# Altium schematic sheet УШЯИ.411618.029Э Э3 Лист 5.schdoc (part 2 of 2)
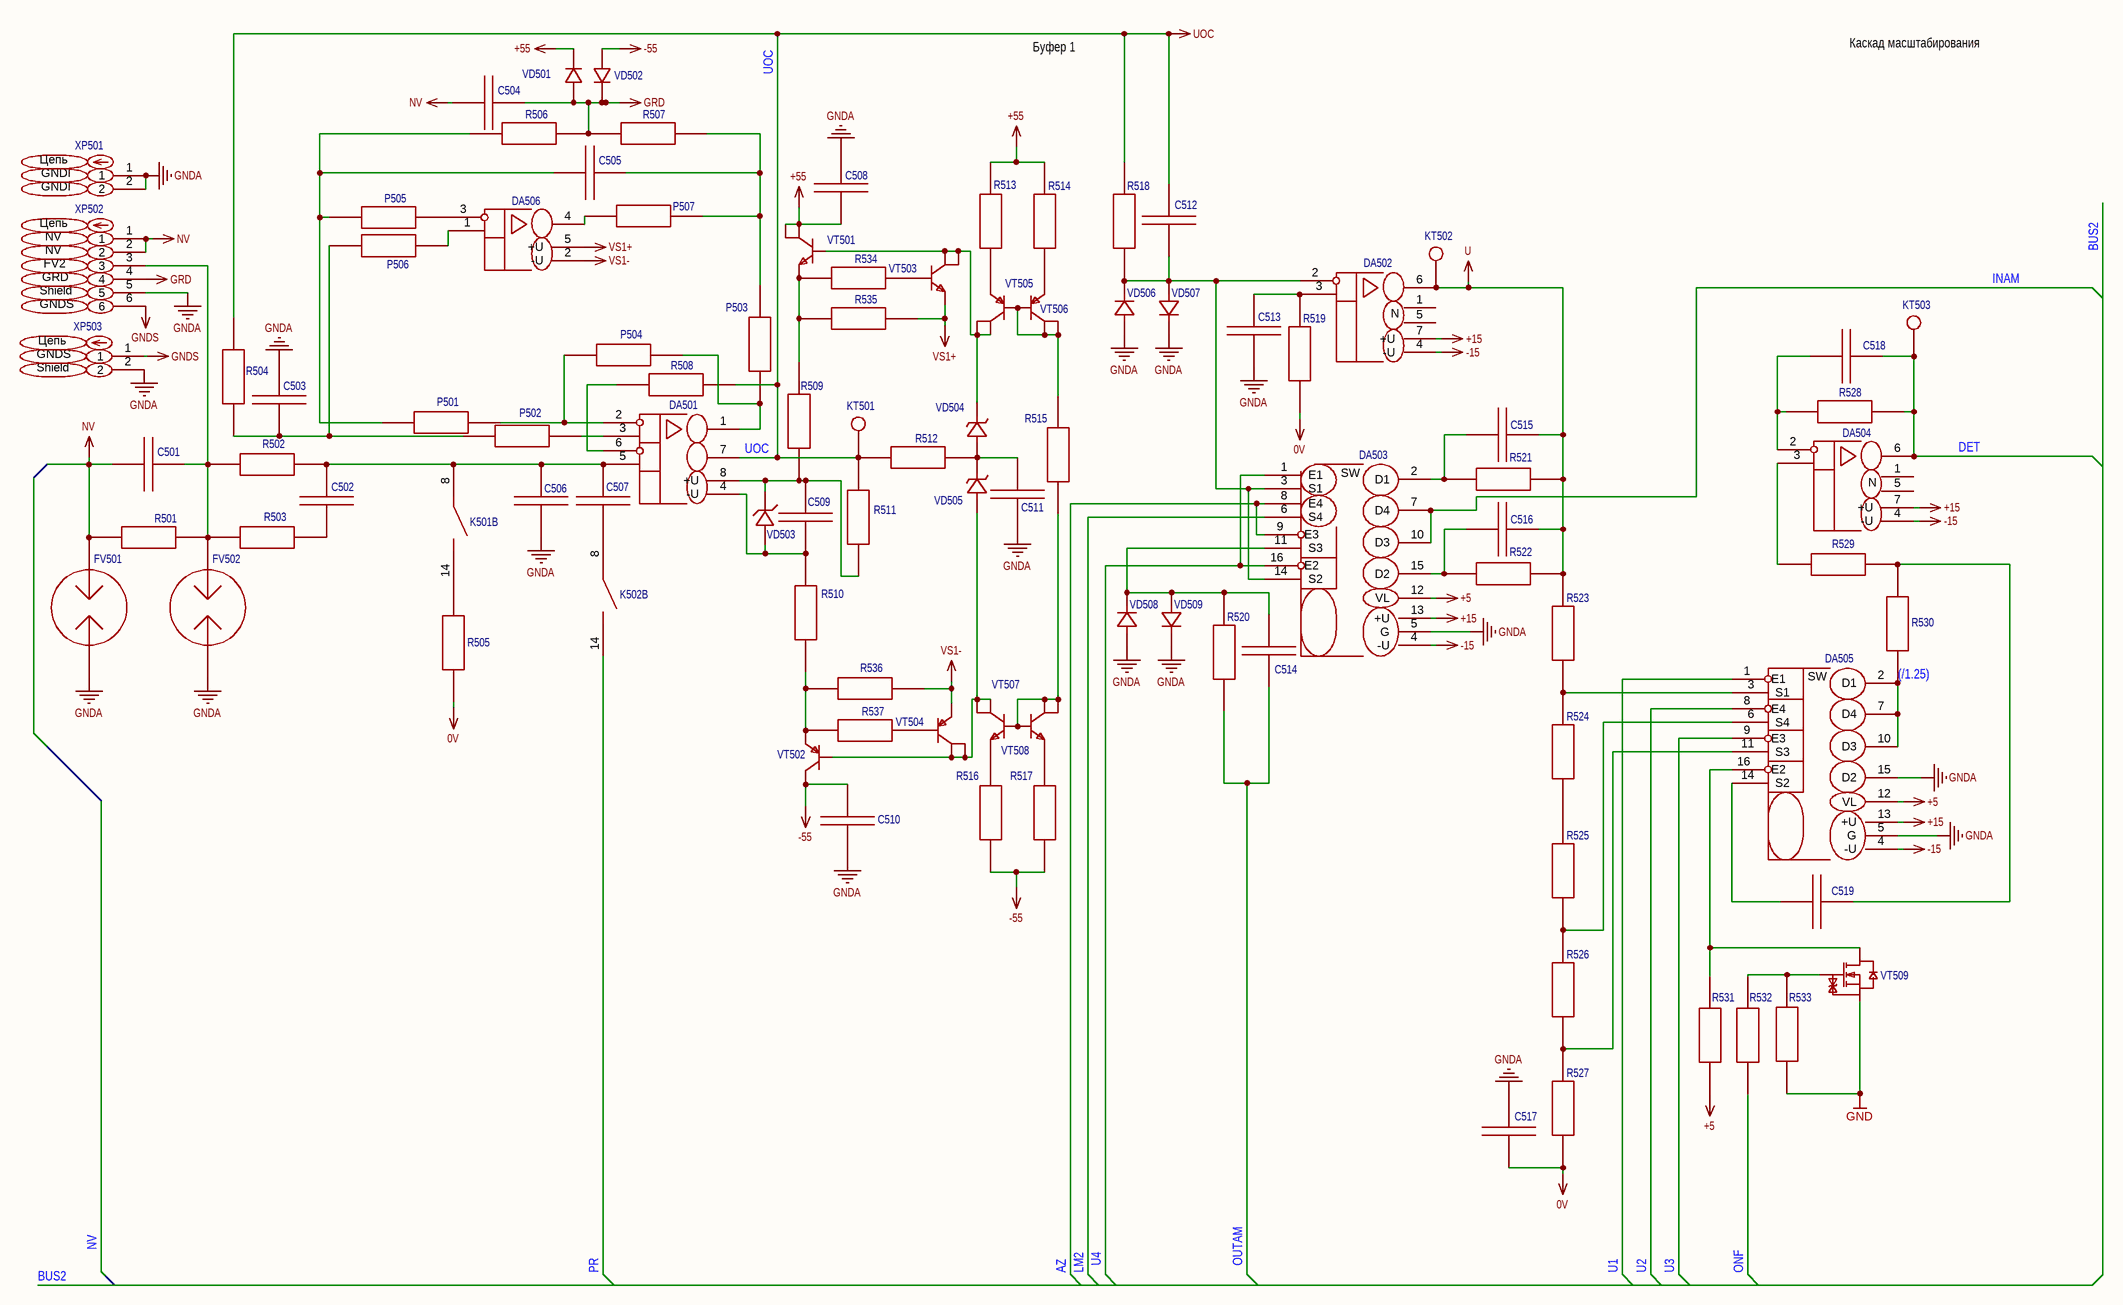
[diagram p1: УШЯИ.411618.029Э Э3 Лист 5.schdoc]

## Library data of the parts
C501 = Конденсатор К10-17Б М47 47пФ  NP0 5% [DIP]: Contributor: jordanjin; Convert to PCB: yes; UniqueId: gge491fe3ed6471c83b; Origin Footprint: К10-17Б М47; Device: Конденсатор К10-17Б М47 47пФ  NP0 5% [DIP]; Symbol: Конденсатор К10-17Б М47 47пФ  NP0 5% [DIP]; Manufacturer Part: К10-17Б М47; Add into BOM: yes; spicePre: C; spiceSymbolName: Конденсатор К10-17Б М47 33пФ NP0 5% [DIP]
C502 = Конденсатор К10-17Б М47 47пФ  NP0 5% [DIP]: Contributor: jordanjin; Convert to PCB: yes; UniqueId: gge052eea8d6ff6ddb1; Origin Footprint: К10-17Б М47; Device: Конденсатор К10-17Б М47 47пФ  NP0 5% [DIP]; Symbol: Конденсатор К10-17Б М47 47пФ  NP0 5% [DIP]; Manufacturer Part: К10-17Б М47; Add into BOM: yes; spicePre: C; spiceSymbolName: Конденсатор К10-17Б М47 33пФ NP0 5% [DIP]
C503 = Конденсатор SMD 10пФ 100В X7R 10% [0805]: Contributor: jordanjin; Convert to PCB: yes; UniqueId: gge9d51e8d6ddafb28b; Origin Footprint: C0805; Device: Конденсатор SMD 10пФ 100В X7R 10% [0805]; Symbol: Конденсатор SMD 10пФ 100В X7R 10% [0805]; Manufacturer Part: C0805; Add into BOM: yes; spicePre: C; spiceSymbolName: Конденсатор SMD 100нФ 100В X7R 10% [0805]; FootprintName: C0805
C504 = Конденсатор К10-17Б М47 0,022мкФ  NP0 5% [DIP]: Contributor: jordanjin; Convert to PCB: yes; UniqueId: ggef415597d1a4119d4; Origin Footprint: К10-17Б М47; Device: Конденсатор К10-17Б М47 0,022мкФ  NP0 5% [DIP]; Symbol: Конденсатор К10-17Б М47 0,022мкФ  NP0 5% [DIP]; Manufacturer Part: К10-17Б М47; Add into BOM: yes; spicePre: C; spiceSymbolName: Конденсатор К10-17Б М47 33пФ NP0 5% [DIP]
C505 = Конденсатор К10-17Б М47 10пФ  NP0 5% [DIP]: Contributor: jordanjin; Convert to PCB: yes; UniqueId: gge0dc5cfc7d6f056c5; Origin Footprint: К10-17Б М47; Device: Конденсатор К10-17Б М47 10пФ  NP0 5% [DIP]; Symbol: Конденсатор К10-17Б М47 10пФ  NP0 5% [DIP]; Manufacturer Part: К10-17Б М47; Add into BOM: yes; spicePre: C; spiceSymbolName: Конденсатор К10-17Б М47 33пФ NP0 5% [DIP]
C506 = Конденсатор К10-17Б М47 33пФ  NP0 5% [DIP]: Contributor: jordanjin; Convert to PCB: yes; UniqueId: gge7a5b28f25b65ab49; Origin Footprint: К10-17Б М47; Device: Конденсатор К10-17Б М47 33пФ  NP0 5% [DIP]; Symbol: Конденсатор К10-17Б М47 33пФ  NP0 5% [DIP]; Manufacturer Part: К10-17Б М47; Add into BOM: yes; spicePre: C; spiceSymbolName: Конденсатор К10-17Б М47 33пФ NP0 5% [DIP]
C507 = Конденсатор К10-17Б М47 47пФ  NP0 5% [DIP]: Contributor: jordanjin; Convert to PCB: yes; UniqueId: gge5cfa99d14830be0f; Origin Footprint: К10-17Б М47; Device: Конденсатор К10-17Б М47 47пФ  NP0 5% [DIP]; Symbol: Конденсатор К10-17Б М47 47пФ  NP0 5% [DIP]; Manufacturer Part: К10-17Б М47; Add into BOM: yes; spicePre: C; spiceSymbolName: Конденсатор К10-17Б М47 33пФ NP0 5% [DIP]
C508 = Конденсатор SMD 0,068мкФ 100В X7R 10% [0805]: Contributor: jordanjin; Convert to PCB: yes; UniqueId: gge46037e06d51267f8; Origin Footprint: C0805; Device: Конденсатор SMD 0,068мкФ 100В X7R 10% [0805]; Symbol: Конденсатор SMD 0,068мкФ 100В X7R 10% [0805]; Manufacturer Part: C0805; Add into BOM: yes; spicePre: C; spiceSymbolName: Конденсатор SMD 100нФ 100В X7R 10% [0805]; FootprintName: C0805
C509 = Конденсатор SMD 5600пФ 100В X7R 10% [0805]: Contributor: jordanjin; Convert to PCB: yes; UniqueId: gge46ae2ed219a196fe; Origin Footprint: C0805; Device: Конденсатор SMD 5600пФ 100В X7R 10% [0805]; Symbol: Конденсатор SMD 5600пФ 100В X7R 10% [0805]; Manufacturer Part: C0805; Add into BOM: yes; spicePre: C; spiceSymbolName: Конденсатор SMD 100нФ 100В X7R 10% [0805]; FootprintName: C0805
C510 = Конденсатор SMD 0,068мкФ 100В X7R 10% [0805]: Contributor: jordanjin; Convert to PCB: yes; UniqueId: gge9d86d277a0576b2a; Origin Footprint: C0805; Device: Конденсатор SMD 0,068мкФ 100В X7R 10% [0805]; Symbol: Конденсатор SMD 0,068мкФ 100В X7R 10% [0805]; Manufacturer Part: C0805; Add into BOM: yes; spicePre: C; spiceSymbolName: Конденсатор SMD 100нФ 100В X7R 10% [0805]; FootprintName: C0805
C511 = Конденсатор SMD 100пФ 100В X7R 10% [0805]: Contributor: jordanjin; Convert to PCB: yes; UniqueId: ggef9b30b69925e5713; Origin Footprint: C0805; Device: Конденсатор SMD 100пФ 100В X7R 10% [0805]; Symbol: Конденсатор SMD 100пФ 100В X7R 10% [0805]; Manufacturer Part: C0805; Add into BOM: yes; spicePre: C; spiceSymbolName: Конденсатор SMD 100нФ 100В X7R 10% [0805]; FootprintName: C0805
C512 = Конденсатор SMD 10пФ 100В X7R 10% [0805]: Contributor: jordanjin; Convert to PCB: yes; UniqueId: ggebd9749fa172219f8; Origin Footprint: C0805; Device: Конденсатор SMD 10пФ 100В X7R 10% [0805]; Symbol: Конденсатор SMD 10пФ 100В X7R 10% [0805]; Manufacturer Part: C0805; Add into BOM: yes; spicePre: C; spiceSymbolName: Конденсатор SMD 100нФ 100В X7R 10% [0805]; FootprintName: C0805
C513 = Конденсатор SMD 51пФ 100В X7R 10% [0805]: Contributor: jordanjin; Convert to PCB: yes; UniqueId: ggef579e639a66e4825; Origin Footprint: C0805; Device: Конденсатор SMD 51пФ 100В X7R 10% [0805]; Symbol: Конденсатор SMD 51пФ 100В X7R 10% [0805]; Manufacturer Part: C0805; Add into BOM: yes; spicePre: C; spiceSymbolName: Конденсатор SMD 100нФ 100В X7R 10% [0805]; FootprintName: C0805
C514 = Конденсатор SMD 1500пФ 100В X7R 10% [0805]: Contributor: jordanjin; Convert to PCB: yes; UniqueId: ggeffbae3697dc6129d; Origin Footprint: C0805; Device: Конденсатор SMD 1500пФ 100В X7R 10% [0805]; Symbol: Конденсатор SMD 1500пФ 100В X7R 10% [0805]; Manufacturer Part: C0805; Add into BOM: yes; spicePre: C; spiceSymbolName: Конденсатор SMD 100нФ 100В X7R 10% [0805]; FootprintName: C0805
C515 = Конденсатор SMD 100пФ 100В X7R 10% [0805]: Contributor: jordanjin; Convert to PCB: yes; UniqueId: gge9bc8ec9642d03d6f; Origin Footprint: C0805; Device: Конденсатор SMD 100пФ 100В X7R 10% [0805]; Symbol: Конденсатор SMD 100пФ 100В X7R 10% [0805]; Manufacturer Part: C0805; Add into BOM: yes; spicePre: C; spiceSymbolName: Конденсатор SMD 100нФ 100В X7R 10% [0805]; FootprintName: C0805
C516 = Конденсатор SMD 10пФ 100В X7R 10% [0805]: Contributor: jordanjin; Convert to PCB: yes; UniqueId: gge9500615235284885; Origin Footprint: C0805; Device: Конденсатор SMD 10пФ 100В X7R 10% [0805]; Symbol: Конденсатор SMD 10пФ 100В X7R 10% [0805]; Manufacturer Part: C0805; Add into BOM: yes; spicePre: C; spiceSymbolName: Конденсатор SMD 100нФ 100В X7R 10% [0805]; FootprintName: C0805
C517 = Конденсатор SMD 240пФ 100В X7R 10% [0805]: Contributor: jordanjin; Convert to PCB: yes; UniqueId: ggeee2486d6007981f5; Origin Footprint: C0805; Device: Конденсатор SMD 240пФ 100В X7R 10% [0805]; Symbol: Конденсатор SMD 240пФ 100В X7R 10% [0805]; Manufacturer Part: C0805; Add into BOM: yes; spicePre: C; spiceSymbolName: Конденсатор SMD 100нФ 100В X7R 10% [0805]; FootprintName: C0805
C518 = Конденсатор SMD 33пФ 100В X7R 10% [0805]: Contributor: jordanjin; Convert to PCB: yes; UniqueId: ggeb634362126cd7a9d; Origin Footprint: C0805; Device: Конденсатор SMD 33пФ 100В X7R 10% [0805]; Symbol: Конденсатор SMD 33пФ 100В X7R 10% [0805]; Manufacturer Part: C0805; Add into BOM: yes; spicePre: C; spiceSymbolName: Конденсатор SMD 100нФ 100В X7R 10% [0805]; FootprintName: C0805
C519 = Конденсатор SMD 1500пФ 100В X7R 10% [0805]: Contributor: jordanjin; Convert to PCB: yes; UniqueId: ggead24cbcaccc537ae; Origin Footprint: C0805; Device: Конденсатор SMD 1500пФ 100В X7R 10% [0805]; Symbol: Конденсатор SMD 1500пФ 100В X7R 10% [0805]; Manufacturer Part: C0805; Add into BOM: yes; spicePre: C; spiceSymbolName: Конденсатор SMD 100нФ 100В X7R 10% [0805]; FootprintName: C0805
DA501 = Операционный усилитель TLV9152IDR [SOIC-8]: subpart_no: 1; Manufacturer: TI; Contributor: jordanjin; Convert to PCB: yes; UniqueId: gge033c9b9fe725b307; Origin Footprint: SOIC-8_L4.9-W3.9-P1.27-LS6.0-BL; Device: Операционный усилитель TLV9152IDR [SOIC-8]; Symbol: Операционный усилитель TLV9152IDR [SOIC-8]; Supplier: LCSC; Manufacturer Part: TLV9152IDR; JLCPCB Part Class: Extended Part; spicePre: D; spiceSymbolName: Операционный усилитель TLV9152IDR [SOIC-8]; Add into BOM: yes; FootprintName: SOIC-8_L4.9-W3.9-P1.27-LS6.0-BL
DA502 = Операционный усилитель ADA4627-1BRZ [SOIC-8]: Manufacturer: Analog Devices; Contributor: jordanjin; Convert to PCB: yes; UniqueId: gge3bbaef5c86713b63; ModelId: 08ee08ca4db744298953d7a1ad16709b; Origin Footprint: SOIC-8_L5.0-W4.0-P1.27-LS6.1-BL; Device: Операционный усилитель ADA4627-1BRZ [SOIC-8]; Symbol: Операционный усилитель ADA4627-1BRZ [SOIC-8]; Supplier: LCSC; Manufacturer Part: ADA4627-1BRZ; JLCPCB Part Class: Extended Part; spicePre: D; spiceSymbolName: Операционный усилитель ADA4627-1BRZ [SOIC-8]; Add into BOM: yes; FootprintName: SOIC-8_L5.0-W4.0-P1.27-LS6.1-BL; ModelName: SOIC-8_L5.0-W4.0-P1.27-LS6.1-BL
DA503 = Коммутатор аналоговых сигналов ADG433BRZ [SOIC-16]: Manufacturer: Analog Devices; Manufacturer Part: ADG433BRZ-REEL; Contributor: jordanjin; Convert to PCB: yes; UniqueId: gge812f241916226e6f; Origin Footprint: SOIC-16_L9.9-W3.9-P1.27-LS6.0-BL; Device: Коммутатор аналоговых сигналов ADG433BRZ [SOIC-16]; Symbol: Коммутатор аналоговых сигналов ADG433BRZ [SOIC-16]; Supplier: LCSC; Supplier Part: C655338; JLCPCB Part Class: Extended Part; spicePre: D; spiceSymbolName: Коммутатор аналоговых сигналов ADG433BRZ [SOIC-16]; Add into BOM: yes; FootprintName: SOIC-16_L9.9-W3.9-P1.27-LS6.0-BL
DA504 = Операционный усилитель ADA4627-1BRZ [SOIC-8]: Manufacturer: Analog Devices; Contributor: jordanjin; Convert to PCB: yes; UniqueId: gge3cb18010d39f84ed; ModelId: 08ee08ca4db744298953d7a1ad16709b; Origin Footprint: SOIC-8_L5.0-W4.0-P1.27-LS6.1-BL; Device: Операционный усилитель ADA4627-1BRZ [SOIC-8]; Symbol: Операционный усилитель ADA4627-1BRZ [SOIC-8]; Supplier: LCSC; Manufacturer Part: ADA4627-1BRZ; JLCPCB Part Class: Extended Part; spicePre: D; spiceSymbolName: Операционный усилитель ADA4627-1BRZ [SOIC-8]; Add into BOM: yes; FootprintName: SOIC-8_L5.0-W4.0-P1.27-LS6.1-BL; ModelName: SOIC-8_L5.0-W4.0-P1.27-LS6.1-BL
DA505 = Коммутатор аналоговых сигналов ADG431BRZ [SOIC-16]: Manufacturer: Analog Devices; Contributor: jordanjin; Convert to PCB: yes; UniqueId: ggee3244cdb455d65e9; Origin Footprint: SOIC-16_L9.9-W3.9-P1.27-LS6.0-BL; Device: Коммутатор аналоговых сигналов ADG431BRZ [SOIC-16]; Symbol: Коммутатор аналоговых сигналов ADG431BRZ [SOIC-16]; Supplier: LCSC; Supplier Part: C208635; Manufacturer Part: ADG431BRZ; JLCPCB Part Class: Extended Part; spicePre: D; spiceSymbolName: Коммутатор аналоговых сигналов ADG431BRZ [SOIC-16]; Add into BOM: yes; FootprintName: SOIC-16_L9.9-W3.9-P1.27-LS6.0-BL
DA506 = Операционный усилитель  TLV9151IDCKR [SC-70-5]: Manufacturer: TI; Contributor: jordanjin; Convert to PCB: yes; UniqueId: gge7952d72f13b2eb4d; ModelId: 60a1a4557aef4fdaa648856c7323bd7f; Origin Footprint: SC-70-5_L2.1-W1.3-P0.65-LS2.2-BR; Device: Операционный усилитель  TLV9151IDCKR [SC-70-5]; Symbol: Операционный усилитель  TLV9151IDCKR [SC-70-5]; Supplier: LCSC; Manufacturer Part: TLV9151IDCKR; JLCPCB Part Class: Extended Part; spicePre: U; spiceSymbolName: Операционный усилитель  TLV9151IDCKR [SC-70-5]; Add into BOM: yes; FootprintName: SC-70-5_L2.1-W1.3-P0.65-LS2.2-BR; ModelName: SC-70-5_L2.1-W1.3-P0.65-LS2.2-BR
FV501 = Разрядник газонаполненный B88069-X8870-B502 (A81-C90X): Manufacturer: TDK/EPCOS; Contributor: jordanjin; Convert to PCB: yes; UniqueId: gge7d0c9ba83060bbcb; Origin Footprint: B88069-X8870-B502 (A81-C90X); Device: Разрядник газонаполненный B88069-X8870-B502 (A81-C90X); Symbol: Разрядник газонаполненный B88069-X8870-B502 (A81-C90X); Manufacturer Part: B88069-X8870-B502 (A81-C90X); spicePre: F; spiceSymbolName: Разрядник газонаполненный B88069-X8870-B502 (A81-C90X); Add into BOM: yes
FV502 = Разрядник газонаполненный B88069-X8870-B502 (A81-C90X): Manufacturer: TDK/EPCOS; Contributor: jordanjin; Convert to PCB: yes; UniqueId: gge3e96f04a3a81286c; Origin Footprint: B88069-X8870-B502 (A81-C90X); Device: Разрядник газонаполненный B88069-X8870-B502 (A81-C90X); Symbol: Разрядник газонаполненный B88069-X8870-B502 (A81-C90X); Manufacturer Part: B88069-X8870-B502 (A81-C90X); spicePre: F; spiceSymbolName: Разрядник газонаполненный B88069-X8870-B502 (A81-C90X); Add into BOM: yes
K501 = Реле герконовое DIP05-1A72-13L  [PCB]: Manufacturer: STANDEXMEDER; subpart_no: 2; Contributor: jordanjin; Convert to PCB: yes; UniqueId: gge500dad4b87e9423a; Origin Footprint: RELAY-TH_STANDEXMEDER_DIP05-1A72-13L; Device: Реле герконовое DIP05-1A72-13L  [PCB]; Symbol: Реле герконовое DIP05-1A72-13L  [PCB]; Supplier: LCSC; Supplier Part: C1524853; Manufacturer Part: DIP05-1A72-13L; JLCPCB Part Class: Extended Part; spicePre: K; spiceSymbolName: Реле герконовое DIP05-1A72-13L  [PCB]; Add into BOM: yes; FootprintName: RELAY-TH_STANDEXMEDER_DIP05-1A72-13L
K502 = Реле герконовое DIP05-1A72-13L  [PCB]: Manufacturer: STANDEXMEDER; subpart_no: 2; Contributor: jordanjin; Convert to PCB: yes; UniqueId: gge72d686f59a0489bf; Origin Footprint: RELAY-TH_STANDEXMEDER_DIP05-1A72-13L; Device: Реле герконовое DIP05-1A72-13L  [PCB]; Symbol: Реле герконовое DIP05-1A72-13L  [PCB]; Supplier: LCSC; Supplier Part: C1524853; Manufacturer Part: DIP05-1A72-13L; JLCPCB Part Class: Extended Part; spicePre: K; spiceSymbolName: Реле герконовое DIP05-1A72-13L  [PCB]; Add into BOM: yes; FootprintName: RELAY-TH_STANDEXMEDER_DIP05-1A72-13L
KT501 = Control point: Contributor: jordanjin; Convert to PCB: yes; UniqueId: ggedc5fd5dd36978301; Origin Footprint: CONTROL POINT; Device: Control point; Symbol: Control point; Manufacturer Part: Control point; spicePre: K; spiceSymbolName: Control point; Add into BOM: yes
KT502 = Control point: Contributor: jordanjin; Convert to PCB: yes; UniqueId: gge744cfcad2b49a33b; Origin Footprint: CONTROL POINT; Device: Control point; Symbol: Control point; Manufacturer Part: Control point; spicePre: K; spiceSymbolName: Control point; Add into BOM: yes
KT503 = Control point: Contributor: jordanjin; Convert to PCB: yes; UniqueId: gge87ec17736d97cc32; Origin Footprint: CONTROL POINT; Device: Control point; Symbol: Control point; Manufacturer Part: Control point; spicePre: K; spiceSymbolName: Control point; Add into BOM: yes
P501 = Перемычка: Contributor: jordanjin; Convert to PCB: yes; UniqueId: ggedc95e0b956a1c77d; ModelId: de27d504f5024d53a3020ec2611f5e5e; Origin Footprint: R0805; Device: Перемычка; Symbol: Перемычка; Manufacturer Part: R0805; spicePre: R; spiceSymbolName: Резистор 12кОм 0,125Вт 1% [0805]; Add into BOM: yes; FootprintName: R0805; ModelName: R0805
P502 = Перемычка: Contributor: jordanjin; Convert to PCB: yes; UniqueId: gge573c0a9b40f3e6e7; ModelId: de27d504f5024d53a3020ec2611f5e5e; Origin Footprint: R0805; Device: Перемычка; Symbol: Перемычка; Manufacturer Part: R0805; spicePre: R; spiceSymbolName: Резистор 12кОм 0,125Вт 1% [0805]; Add into BOM: yes; FootprintName: R0805; ModelName: R0805
P503 = Перемычка: Contributor: jordanjin; Convert to PCB: yes; UniqueId: ggece0821aceddbed5f; ModelId: de27d504f5024d53a3020ec2611f5e5e; Origin Footprint: R0805; Device: Перемычка; Symbol: Перемычка; Manufacturer Part: R0805; spicePre: R; spiceSymbolName: Резистор 12кОм 0,125Вт 1% [0805]; Add into BOM: yes; FootprintName: R0805; ModelName: R0805
P504 = Перемычка: Contributor: jordanjin; Convert to PCB: yes; UniqueId: gge17aeb560574ae62c; ModelId: de27d504f5024d53a3020ec2611f5e5e; Origin Footprint: R0805; Device: Перемычка; Symbol: Перемычка; Manufacturer Part: R0805; spicePre: R; spiceSymbolName: Резистор 12кОм 0,125Вт 1% [0805]; Add into BOM: yes; FootprintName: R0805; ModelName: R0805
P505 = Перемычка: Contributor: jordanjin; Convert to PCB: yes; UniqueId: gged4e76ffb2bb36451; ModelId: de27d504f5024d53a3020ec2611f5e5e; Origin Footprint: R0805; Device: Перемычка; Symbol: Перемычка; Manufacturer Part: R0805; spicePre: R; spiceSymbolName: Резистор 12кОм 0,125Вт 1% [0805]; Add into BOM: yes; FootprintName: R0805; ModelName: R0805
P506 = Перемычка: Contributor: jordanjin; Convert to PCB: yes; UniqueId: ggec33af18800905152; ModelId: de27d504f5024d53a3020ec2611f5e5e; Origin Footprint: R0805; Device: Перемычка; Symbol: Перемычка; Manufacturer Part: R0805; spicePre: R; spiceSymbolName: Резистор 12кОм 0,125Вт 1% [0805]; Add into BOM: yes; FootprintName: R0805; ModelName: R0805
P507 = Перемычка: Contributor: jordanjin; Convert to PCB: yes; UniqueId: gge82243ce5db2e3be1; ModelId: de27d504f5024d53a3020ec2611f5e5e; Origin Footprint: R0805; Device: Перемычка; Symbol: Перемычка; Manufacturer Part: R0805; spicePre: R; spiceSymbolName: Резистор 12кОм 0,125Вт 1% [0805]; Add into BOM: yes; FootprintName: R0805; ModelName: R0805
R501 = Резистор C2-29В-0,25 1,2кОм ±0,5% [DIP]: Contributor: jordanjin; Convert to PCB: yes; UniqueId: ggee93e24d1da7ce645; Origin Footprint: C2-29В-0,25; Device: Резистор C2-29В-0,25 1,2кОм ±0,5% [DIP]; Symbol: Резистор C2-29В-0,25 1,2кОм ±0,5% [DIP]; Manufacturer Part: C2-29В-0,25; spicePre: R; spiceSymbolName: Резистор C2-29В-0,25 1 МОм ±0,5% [DIP]; Add into BOM: yes
R502 = Резистор C2-29В-0,25 301кОм ±0,5% [DIP]: Contributor: jordanjin; Convert to PCB: yes; UniqueId: ggeaa02f2f272a77a31; Origin Footprint: C2-29В-0,25; Device: Резистор C2-29В-0,25 301кОм ±0,5% [DIP]; Symbol: Резистор C2-29В-0,25 301кОм ±0,5% [DIP]; Manufacturer Part: C2-29В-0,25; spicePre: R; spiceSymbolName: Резистор C2-29В-0,25 1 МОм ±0,5% [DIP]; Add into BOM: yes
R503 = Резистор C2-29В-0,25 5.1кОм ±0,5% [DIP]: Contributor: jordanjin; Convert to PCB: yes; UniqueId: gge30d652682c4d8343; Origin Footprint: C2-29В-0,25; Device: Резистор C2-29В-0,25 5.1кОм ±0,5% [DIP]; Symbol: Резистор C2-29В-0,25 5.1кОм ±0,5% [DIP]; Manufacturer Part: C2-29В-0,25; spicePre: R; spiceSymbolName: Резистор C2-29В-0,25 1 МОм ±0,5% [DIP]; Add into BOM: yes
R504 = Резистор 91кОм 0,125Вт 1% [0805]: Contributor: jordanjin; Convert to PCB: yes; UniqueId: ggeca5f87feb20cb38d; ModelId: de27d504f5024d53a3020ec2611f5e5e; Origin Footprint: R0805; Device: Резистор 91кОм 0,125Вт 1% [0805]; Symbol: Резистор 91кОм 0,125Вт 1% [0805]; Manufacturer Part: R0805; spicePre: R; spiceSymbolName: Резистор 12кОм 0,125Вт 1% [0805]; Add into BOM: yes; FootprintName: R0805; ModelName: R0805
R505 = Резистор C2-29В-0,25 2.4кОм ±0,5% [DIP]: Contributor: jordanjin; Convert to PCB: yes; UniqueId: ggea641fbde0dbc1567; Origin Footprint: C2-29В-0,25; Device: Резистор C2-29В-0,25 2.4кОм ±0,5% [DIP]; Symbol: Резистор C2-29В-0,25 2.4кОм ±0,5% [DIP]; Manufacturer Part: C2-29В-0,25; spicePre: R; spiceSymbolName: Резистор C2-29В-0,25 1 МОм ±0,5% [DIP]; Add into BOM: yes
R506 = Резистор C2-29В-0,25 51Ом ±0,5% [DIP]: Contributor: jordanjin; Convert to PCB: yes; UniqueId: gge15c8eac15c87a708; Origin Footprint: C2-29В-0,25; Device: Резистор C2-29В-0,25 51Ом ±0,5% [DIP]; Symbol: Резистор C2-29В-0,25 51Ом ±0,5% [DIP]; Manufacturer Part: C2-29В-0,25; spicePre: R; spiceSymbolName: Резистор C2-29В-0,25 1 МОм ±0,5% [DIP]; Add into BOM: yes
R507 = Резистор C2-29В-0,25 22Ом ±0,5% [DIP]: Contributor: jordanjin; Convert to PCB: yes; UniqueId: gge019dd6bd1159dd67; Origin Footprint: C2-29В-0,25; Device: Резистор C2-29В-0,25 22Ом ±0,5% [DIP]; Symbol: Резистор C2-29В-0,25 22Ом ±0,5% [DIP]; Manufacturer Part: C2-29В-0,25; spicePre: R; spiceSymbolName: Резистор C2-29В-0,25 1 МОм ±0,5% [DIP]; Add into BOM: yes
R508 = Резистор 33Ом 0,125Вт 1% [0805]: Contributor: jordanjin; Convert to PCB: yes; UniqueId: gge0f859b7ba0d77a41; ModelId: de27d504f5024d53a3020ec2611f5e5e; Origin Footprint: R0805; Device: Резистор 33Ом 0,125Вт 1% [0805]; Symbol: Резистор 33Ом 0,125Вт 1% [0805]; Manufacturer Part: R0805; spicePre: R; spiceSymbolName: Резистор 12кОм 0,125Вт 1% [0805]; Add into BOM: yes; FootprintName: R0805; ModelName: R0805
R509 = Резистор 150Ом 0,125Вт 1% [0805]: Contributor: jordanjin; Convert to PCB: yes; UniqueId: gge19b11993ae8ddbec; ModelId: de27d504f5024d53a3020ec2611f5e5e; Origin Footprint: R0805; Device: Резистор 150Ом 0,125Вт 1% [0805]; Symbol: Резистор 150Ом 0,125Вт 1% [0805]; Manufacturer Part: R0805; spicePre: R; spiceSymbolName: Резистор 12кОм 0,125Вт 1% [0805]; Add into BOM: yes; FootprintName: R0805; ModelName: R0805
R510 = Резистор 150Ом 0,125Вт 1% [0805]: Contributor: jordanjin; Convert to PCB: yes; UniqueId: gge30a279dbde92e2c2; ModelId: de27d504f5024d53a3020ec2611f5e5e; Origin Footprint: R0805; Device: Резистор 150Ом 0,125Вт 1% [0805]; Symbol: Резистор 150Ом 0,125Вт 1% [0805]; Manufacturer Part: R0805; spicePre: R; spiceSymbolName: Резистор 12кОм 0,125Вт 1% [0805]; Add into BOM: yes; FootprintName: R0805; ModelName: R0805
R511 = Резистор 5,1кОм 0,125Вт 1% [0805]: Contributor: jordanjin; Convert to PCB: yes; UniqueId: ggeb00228bcc1e033b7; ModelId: de27d504f5024d53a3020ec2611f5e5e; Origin Footprint: R0805; Device: Резистор 5,1кОм 0,125Вт 1% [0805]; Symbol: Резистор 5,1кОм 0,125Вт 1% [0805]; Manufacturer Part: R0805; spicePre: R; spiceSymbolName: Резистор 12кОм 0,125Вт 1% [0805]; Add into BOM: yes; FootprintName: R0805; ModelName: R0805
R512 = Резистор 4,7кОм 0,125Вт 1% [0805]: Contributor: jordanjin; Convert to PCB: yes; UniqueId: gge158a6589a4122026; ModelId: de27d504f5024d53a3020ec2611f5e5e; Origin Footprint: R0805; Device: Резистор 4,7кОм 0,125Вт 1% [0805]; Symbol: Резистор 4,7кОм 0,125Вт 1% [0805]; Manufacturer Part: R0805; spicePre: R; spiceSymbolName: Резистор 12кОм 0,125Вт 1% [0805]; Add into BOM: yes; FootprintName: R0805; ModelName: R0805
R513 = Резистор 820Ом 0,125Вт 1% [0805]: Contributor: jordanjin; Convert to PCB: yes; UniqueId: gge599caade6e81035f; ModelId: de27d504f5024d53a3020ec2611f5e5e; Origin Footprint: R0805; Device: Резистор 820Ом 0,125Вт 1% [0805]; Symbol: Резистор 820Ом 0,125Вт 1% [0805]; Manufacturer Part: R0805; spicePre: R; spiceSymbolName: Резистор 12кОм 0,125Вт 1% [0805]; Add into BOM: yes; FootprintName: R0805; ModelName: R0805
R514 = Резистор 2кОм 0,125Вт 1% [0805]: Contributor: jordanjin; Convert to PCB: yes; UniqueId: ggece419a692d21afa2; ModelId: de27d504f5024d53a3020ec2611f5e5e; Origin Footprint: R0805; Device: Резистор 2кОм 0,125Вт 1% [0805]; Symbol: Резистор 2кОм 0,125Вт 1% [0805]; Manufacturer Part: R0805; spicePre: R; spiceSymbolName: Резистор 12кОм 0,125Вт 1% [0805]; Add into BOM: yes; FootprintName: R0805; ModelName: R0805
R515 = Резистор 200кОм 0,125Вт 1% [0805]: Contributor: jordanjin; Convert to PCB: yes; UniqueId: gge4765c4e9bd5e6808; ModelId: de27d504f5024d53a3020ec2611f5e5e; Origin Footprint: R0805; Device: Резистор 200кОм 0,125Вт 1% [0805]; Symbol: Резистор 200кОм 0,125Вт 1% [0805]; Manufacturer Part: R0805; spicePre: R; spiceSymbolName: Резистор 12кОм 0,125Вт 1% [0805]; Add into BOM: yes; FootprintName: R0805; ModelName: R0805
R516 = Резистор 820Ом 0,125Вт 1% [0805]: Contributor: jordanjin; Convert to PCB: yes; UniqueId: ggec1592c67165e4b58; ModelId: de27d504f5024d53a3020ec2611f5e5e; Origin Footprint: R0805; Device: Резистор 820Ом 0,125Вт 1% [0805]; Symbol: Резистор 820Ом 0,125Вт 1% [0805]; Manufacturer Part: R0805; spicePre: R; spiceSymbolName: Резистор 12кОм 0,125Вт 1% [0805]; Add into BOM: yes; FootprintName: R0805; ModelName: R0805
R517 = Резистор 2кОм 0,125Вт 1% [0805]: Contributor: jordanjin; Convert to PCB: yes; UniqueId: gge5118a76a8e2901a3; ModelId: de27d504f5024d53a3020ec2611f5e5e; Origin Footprint: R0805; Device: Резистор 2кОм 0,125Вт 1% [0805]; Symbol: Резистор 2кОм 0,125Вт 1% [0805]; Manufacturer Part: R0805; spicePre: R; spiceSymbolName: Резистор 12кОм 0,125Вт 1% [0805]; Add into BOM: yes; FootprintName: R0805; ModelName: R0805
R518 = Резистор 40,2кОм 0.25Вт 1% [1206]: Contributor: jordanjin; Convert to PCB: yes; UniqueId: gge080981316cda412b; ModelId: de27d504f5024d53a3020ec2611f5e5e; Origin Footprint: R0805; Device: Резистор 40,2кОм 0.25Вт 1% [1206]; Symbol: Резистор 40,2кОм 0.25Вт 1% [1206]; Manufacturer Part: R0805; spicePre: R; spiceSymbolName: Резистор 12кОм 0,125Вт 1% [0805]; Add into BOM: yes; FootprintName: R0805; ModelName: R0805
R519 = Резистор 15кОм 0,125Вт 1% [0805]: Contributor: jordanjin; Convert to PCB: yes; UniqueId: ggee26b7d08d16a2d39; ModelId: de27d504f5024d53a3020ec2611f5e5e; Origin Footprint: R0805; Device: Резистор 15кОм 0,125Вт 1% [0805]; Symbol: Резистор 15кОм 0,125Вт 1% [0805]; Manufacturer Part: R0805; spicePre: R; spiceSymbolName: Резистор 12кОм 0,125Вт 1% [0805]; Add into BOM: yes; FootprintName: R0805; ModelName: R0805
R520 = Резистор 200кОм 0,125Вт 1% [0805]: Contributor: jordanjin; Convert to PCB: yes; UniqueId: gge3d1eef37f3680d67; ModelId: de27d504f5024d53a3020ec2611f5e5e; Origin Footprint: R0805; Device: Резистор 200кОм 0,125Вт 1% [0805]; Symbol: Резистор 200кОм 0,125Вт 1% [0805]; Manufacturer Part: R0805; spicePre: R; spiceSymbolName: Резистор 12кОм 0,125Вт 1% [0805]; Add into BOM: yes; FootprintName: R0805; ModelName: R0805
R521 = Резистор 10кОм 0,125Вт 1% [0805]: Contributor: jordanjin; Convert to PCB: yes; UniqueId: gge1f9880c1a99a26b6; ModelId: de27d504f5024d53a3020ec2611f5e5e; Origin Footprint: R0805; Device: Резистор 10кОм 0,125Вт 1% [0805]; Symbol: Резистор 10кОм 0,125Вт 1% [0805]; Manufacturer Part: R0805; spicePre: R; spiceSymbolName: Резистор 12кОм 0,125Вт 1% [0805]; Add into BOM: yes; FootprintName: R0805; ModelName: R0805
R522 = Резистор 100кОм 0,125Вт 1% [0805]: Contributor: jordanjin; Convert to PCB: yes; UniqueId: gge301ff49d7d9137b8; ModelId: de27d504f5024d53a3020ec2611f5e5e; Origin Footprint: R0805; Device: Резистор 100кОм 0,125Вт 1% [0805]; Symbol: Резистор 100кОм 0,125Вт 1% [0805]; Manufacturer Part: R0805; spicePre: R; spiceSymbolName: Резистор 12кОм 0,125Вт 1% [0805]; Add into BOM: yes; FootprintName: R0805; ModelName: R0805
R523 = Резистор 4,02кОм 0.25Вт 1% [1206]: Contributor: jordanjin; Convert to PCB: yes; UniqueId: gge14753fe53ea0679b; Origin Footprint: R1206; Device: Резистор 4,02кОм 0.25Вт 1% [1206]; Symbol: Резистор 4,02кОм 0.25Вт 1% [1206]; Manufacturer Part: R1206; spicePre: R; spiceSymbolName: Резистор 12кОм 0,25Вт 1% [1206]; Add into BOM: yes; FootprintName: R1206
R524 = Резистор 4,02кОм 0.25Вт 1% [1206]: Contributor: jordanjin; Convert to PCB: yes; UniqueId: gge013a5ba9a346bf91; Origin Footprint: R1206; Device: Резистор 4,02кОм 0.25Вт 1% [1206]; Symbol: Резистор 4,02кОм 0.25Вт 1% [1206]; Manufacturer Part: R1206; spicePre: R; spiceSymbolName: Резистор 12кОм 0,25Вт 1% [1206]; Add into BOM: yes; FootprintName: R1206
R525 = Резистор 4,02кОм 0.25Вт 1% [1206]: Contributor: jordanjin; Convert to PCB: yes; UniqueId: ggeee7ff1649821f986; Origin Footprint: R1206; Device: Резистор 4,02кОм 0.25Вт 1% [1206]; Symbol: Резистор 4,02кОм 0.25Вт 1% [1206]; Manufacturer Part: R1206; spicePre: R; spiceSymbolName: Резистор 12кОм 0,25Вт 1% [1206]; Add into BOM: yes; FootprintName: R1206
R526 = Резистор 4,02кОм 0.25Вт 1% [1206]: Contributor: jordanjin; Convert to PCB: yes; UniqueId: gge439789adcec64be8; Origin Footprint: R1206; Device: Резистор 4,02кОм 0.25Вт 1% [1206]; Symbol: Резистор 4,02кОм 0.25Вт 1% [1206]; Manufacturer Part: R1206; spicePre: R; spiceSymbolName: Резистор 12кОм 0,25Вт 1% [1206]; Add into BOM: yes; FootprintName: R1206
R527 = Резистор 4,02кОм 0.25Вт 1% [1206]: Contributor: jordanjin; Convert to PCB: yes; UniqueId: gge8942019ccbc340b8; Origin Footprint: R1206; Device: Резистор 4,02кОм 0.25Вт 1% [1206]; Symbol: Резистор 4,02кОм 0.25Вт 1% [1206]; Manufacturer Part: R1206; spicePre: R; spiceSymbolName: Резистор 12кОм 0,25Вт 1% [1206]; Add into BOM: yes; FootprintName: R1206
R528 = Резистор 3,6кОм 0,125Вт 1% [0805]: Contributor: jordanjin; Convert to PCB: yes; UniqueId: gge6ded2c844e8eef63; ModelId: de27d504f5024d53a3020ec2611f5e5e; Origin Footprint: R0805; Device: Резистор 3,6кОм 0,125Вт 1% [0805]; Symbol: Резистор 3,6кОм 0,125Вт 1% [0805]; Manufacturer Part: R0805; spicePre: R; spiceSymbolName: Резистор 12кОм 0,125Вт 1% [0805]; Add into BOM: yes; FootprintName: R0805; ModelName: R0805
R529 = Резистор 110кОм 0,125Вт 1% [0805]: Contributor: jordanjin; Convert to PCB: yes; UniqueId: gge0039357b24a0ea0d; ModelId: de27d504f5024d53a3020ec2611f5e5e; Origin Footprint: R0805; Device: Резистор 110кОм 0,125Вт 1% [0805]; Symbol: Резистор 110кОм 0,125Вт 1% [0805]; Manufacturer Part: R0805; spicePre: R; spiceSymbolName: Резистор 12кОм 0,125Вт 1% [0805]; Add into BOM: yes; FootprintName: R0805; ModelName: R0805
R530 = Резистор 110кОм 0,125Вт 1% [0805]: Contributor: jordanjin; Convert to PCB: yes; UniqueId: ggee28c8bde2ceb3893; ModelId: de27d504f5024d53a3020ec2611f5e5e; Origin Footprint: R0805; Device: Резистор 110кОм 0,125Вт 1% [0805]; Symbol: Резистор 110кОм 0,125Вт 1% [0805]; Manufacturer Part: R0805; spicePre: R; spiceSymbolName: Резистор 12кОм 0,125Вт 1% [0805]; Add into BOM: yes; FootprintName: R0805; ModelName: R0805
R531 = Резистор 5,3кОм 0,125Вт 1% [0805]: Contributor: jordanjin; Convert to PCB: yes; UniqueId: ggedcd3b63f08ea3a0a; ModelId: de27d504f5024d53a3020ec2611f5e5e; Origin Footprint: R0805; Device: Резистор 5,3кОм 0,125Вт 1% [0805]; Symbol: Резистор 5,3кОм 0,125Вт 1% [0805]; Manufacturer Part: R0805; spicePre: R; spiceSymbolName: Резистор 100Ом 0,125Вт 1% [DIP]; Add into BOM: yes; FootprintName: R0805; ModelName: R0805
R532 = Резистор 100Ом 0,125Вт 1% [0805]: Contributor: jordanjin; Convert to PCB: yes; UniqueId: ggefe2e8d04342d3d3a; ModelId: de27d504f5024d53a3020ec2611f5e5e; Origin Footprint: R0805; Device: Резистор 100Ом 0,125Вт 1% [0805]; Symbol: Резистор 100Ом 0,125Вт 1% [0805]; Manufacturer Part: R0805; spicePre: R; spiceSymbolName: Резистор 100Ом 0,125Вт 1% [DIP]; Add into BOM: yes; FootprintName: R0805; ModelName: R0805
R533 = Резистор 100Ом 0,125Вт 1% [0805]: Contributor: jordanjin; Convert to PCB: yes; UniqueId: ggebf665dc4c1a49d6f; ModelId: de27d504f5024d53a3020ec2611f5e5e; Origin Footprint: R0805; Device: Резистор 100Ом 0,125Вт 1% [0805]; Symbol: Резистор 100Ом 0,125Вт 1% [0805]; Manufacturer Part: R0805; spicePre: R; spiceSymbolName: Резистор 100Ом 0,125Вт 1% [DIP]; Add into BOM: yes; FootprintName: R0805; ModelName: R0805
R534 = Резистор 400Ом 0,125Вт 1% [0805]: Contributor: jordanjin; Convert to PCB: yes; UniqueId: ggeb0de60753b426e85; ModelId: de27d504f5024d53a3020ec2611f5e5e; Origin Footprint: R0805; Device: Резистор 400Ом 0,125Вт 1% [0805]; Symbol: Резистор 400Ом 0,125Вт 1% [0805]; Manufacturer Part: R0805; spicePre: R; spiceSymbolName: Резистор 12кОм 0,125Вт 1% [0805]; Add into BOM: yes; FootprintName: R0805; ModelName: R0805
R535 = Резистор 150Ом 0,125Вт 1% [0805]: Contributor: jordanjin; Convert to PCB: yes; UniqueId: gge75873d43db30fff6; ModelId: de27d504f5024d53a3020ec2611f5e5e; Origin Footprint: R0805; Device: Резистор 150Ом 0,125Вт 1% [0805]; Symbol: Резистор 150Ом 0,125Вт 1% [0805]; Manufacturer Part: R0805; spicePre: R; spiceSymbolName: Резистор 12кОм 0,125Вт 1% [0805]; Add into BOM: yes; FootprintName: R0805; ModelName: R0805
R536 = Резистор 150Ом 0,125Вт 1% [0805]: Contributor: jordanjin; Convert to PCB: yes; UniqueId: gge6925eafdba148f11; ModelId: de27d504f5024d53a3020ec2611f5e5e; Origin Footprint: R0805; Device: Резистор 150Ом 0,125Вт 1% [0805]; Symbol: Резистор 150Ом 0,125Вт 1% [0805]; Manufacturer Part: R0805; spicePre: R; spiceSymbolName: Резистор 12кОм 0,125Вт 1% [0805]; Add into BOM: yes; FootprintName: R0805; ModelName: R0805
R537 = Резистор 400Ом 0,125Вт 1% [0805]: Contributor: jordanjin; Convert to PCB: yes; UniqueId: gge65f651d1f128c3b4; ModelId: de27d504f5024d53a3020ec2611f5e5e; Origin Footprint: R0805; Device: Резистор 400Ом 0,125Вт 1% [0805]; Symbol: Резистор 400Ом 0,125Вт 1% [0805]; Manufacturer Part: R0805; spicePre: R; spiceSymbolName: Резистор 12кОм 0,125Вт 1% [0805]; Add into BOM: yes; FootprintName: R0805; ModelName: R0805
VD501 = Диод импульсный 1N4448 [DO-35]: Manufacturer: onsemi; Manufacturer Part: 1N4448TR; Contributor: jordanjin; Convert to PCB: yes; UniqueId: ggedb55a1684d499d8c; Origin Footprint: DO-35_BD2.0-L4.2-P8.20-D0.5-RD; Device: Диод импульсный 1N4448 [DO-35]; Symbol: Диод импульсный 1N4448 [DO-35]; Supplier: LCSC; JLCPCB Part Class: Extended Part; spicePre: V; spiceSymbolName: Диод импульсный 1N4448 [DO-35]; Add into BOM: yes; FootprintName: DO-35_BD2.0-L4.2-P8.20-D0.5-RD
VD502 = Диод импульсный 1N4448 [DO-35]: Manufacturer: onsemi; Manufacturer Part: 1N4448TR; Contributor: jordanjin; Convert to PCB: yes; UniqueId: gged01192bb1f9db9d4; Origin Footprint: DO-35_BD2.0-L4.2-P8.20-D0.5-RD; Device: Диод импульсный 1N4448 [DO-35]; Symbol: Диод импульсный 1N4448 [DO-35]; Supplier: LCSC; JLCPCB Part Class: Extended Part; spicePre: V; spiceSymbolName: Диод импульсный 1N4448 [DO-35]; Add into BOM: yes; FootprintName: DO-35_BD2.0-L4.2-P8.20-D0.5-RD
VD503 = Стабилитрон MMSZ5230B 4.7В 0.5Вт [SOD123]: Manufacturer: CJ(江苏长电/长晶); Convert to PCB: yes; UniqueId: gged89c8db69f933174; ModelId: 560a7cf99d0e44cb9af362aaf5d7923d; Origin Footprint: SOD-123_L2.8-W1.8-LS3.7-RD; Device: Стабилитрон MMSZ5230B 4.7В 0.5Вт [SOD123]; Symbol: Стабилитрон MMSZ5230B 4.7В 0.5Вт [SOD123]; Supplier: LCSC; Manufacturer Part: MMSZ5230B; Supplier Part: C21553; JLCPCB Part Class: Extended Part; spicePre: Z; spiceSymbolName: MMSZ5230B; Add into BOM: yes; FootprintName: SOD-123_L2.8-W1.8-LS3.7-RD; ModelName: SOD-123_L2.8-W1.8-LS3.7-RD
VD504 = Стабилитрон MMSZ5232B 5.6В 0.5Вт [SOD123]: Manufacturer: MCC(美微科); Manufacturer Part: MMSZ5232B-TP; Contributor: LCSC; Convert to PCB: yes; UniqueId: gge13afb5976fb958f5; Origin Footprint: SOD-123_L2.7-W1.6-LS3.7-RD; Device: Стабилитрон MMSZ5232B 5.6В 0.5Вт [SOD123]; Symbol: Стабилитрон MMSZ5232B 5.6В 0.5Вт [SOD123]; Supplier: LCSC; Supplier Part: C668974; JLCPCB Part Class: Extended Part; spicePre: D; spiceSymbolName: MMSZ5232B-TP; Add into BOM: yes; FootprintName: SOD-123_L2.7-W1.6-LS3.7-RD
VD505 = Стабилитрон MMSZ5232B 5.6В 0.5Вт [SOD123]: Manufacturer: MCC(美微科); Manufacturer Part: MMSZ5232B-TP; Contributor: LCSC; Convert to PCB: yes; UniqueId: gge461a2574b730d459; Origin Footprint: SOD-123_L2.7-W1.6-LS3.7-RD; Device: Стабилитрон MMSZ5232B 5.6В 0.5Вт [SOD123]; Symbol: Стабилитрон MMSZ5232B 5.6В 0.5Вт [SOD123]; Supplier: LCSC; Supplier Part: C668974; JLCPCB Part Class: Extended Part; spicePre: D; spiceSymbolName: MMSZ5232B-TP; Add into BOM: yes; FootprintName: SOD-123_L2.7-W1.6-LS3.7-RD
VD506 = Диод импульсный 1N4448 [SOD-123]: Manufacturer: YANGJIE; Manufacturer Part: 1N4448WQ; Contributor: jordanjin; Convert to PCB: yes; UniqueId: gge2164371196df01db; ModelId: 5a61cd31046d4447ba73169a45a0935b; Origin Footprint: SOD-123_L2.7-W1.6-LS3.7-RD-1; Device: Диод импульсный 1N4448 [SOD-123]; Symbol: Диод импульсный 1N4448 [SOD-123]; Supplier: LCSC; JLCPCB Part Class: Extended Part; spicePre: V; spiceSymbolName: Диод импульсный 1N4448 [SOD-123]; Add into BOM: yes; FootprintName: SOD-123_L2.7-W1.6-LS3.7-RD-1; ModelName: SOD-123_L2.7-W1.6-LS3.7-RD-1
VD507 = Диод импульсный 1N4448 [SOD-123]: Manufacturer: YANGJIE; Manufacturer Part: 1N4448WQ; Contributor: jordanjin; Convert to PCB: yes; UniqueId: ggeefad4db6c371818c; ModelId: 5a61cd31046d4447ba73169a45a0935b; Origin Footprint: SOD-123_L2.7-W1.6-LS3.7-RD-1; Device: Диод импульсный 1N4448 [SOD-123]; Symbol: Диод импульсный 1N4448 [SOD-123]; Supplier: LCSC; JLCPCB Part Class: Extended Part; spicePre: V; spiceSymbolName: Диод импульсный 1N4448 [SOD-123]; Add into BOM: yes; FootprintName: SOD-123_L2.7-W1.6-LS3.7-RD-1; ModelName: SOD-123_L2.7-W1.6-LS3.7-RD-1
VD508 = Диод импульсный 1N4448 [SOD-123]: Manufacturer: YANGJIE; Manufacturer Part: 1N4448WQ; Contributor: jordanjin; Convert to PCB: yes; UniqueId: ggeb2fc8e63b166ca07; ModelId: 5a61cd31046d4447ba73169a45a0935b; Origin Footprint: SOD-123_L2.7-W1.6-LS3.7-RD-1; Device: Диод импульсный 1N4448 [SOD-123]; Symbol: Диод импульсный 1N4448 [SOD-123]; Supplier: LCSC; JLCPCB Part Class: Extended Part; spicePre: V; spiceSymbolName: Диод импульсный 1N4448 [SOD-123]; Add into BOM: yes; FootprintName: SOD-123_L2.7-W1.6-LS3.7-RD-1; ModelName: SOD-123_L2.7-W1.6-LS3.7-RD-1
VD509 = Диод импульсный 1N4448 [SOD-123]: Manufacturer: YANGJIE; Manufacturer Part: 1N4448WQ; Contributor: jordanjin; Convert to PCB: yes; UniqueId: gge65a38267476bf464; ModelId: 5a61cd31046d4447ba73169a45a0935b; Origin Footprint: SOD-123_L2.7-W1.6-LS3.7-RD-1; Device: Диод импульсный 1N4448 [SOD-123]; Symbol: Диод импульсный 1N4448 [SOD-123]; Supplier: LCSC; JLCPCB Part Class: Extended Part; spicePre: V; spiceSymbolName: Диод импульсный 1N4448 [SOD-123]; Add into BOM: yes; FootprintName: SOD-123_L2.7-W1.6-LS3.7-RD-1; ModelName: SOD-123_L2.7-W1.6-LS3.7-RD-1
VT501 = Транзистор DZT658 NPN [SOT223]: Manufacturer: DIODES(美台); Manufacturer Part: DZT658-13; Contributor: LCSC; Convert to PCB: yes; UniqueId: ggef5681167696e78ac; Origin Footprint: SOT-223-3_L6.5-W3.4-P2.30-LS7.0-BR; Device: Транзистор DZT658 NPN [SOT223]; Symbol: Транзистор DZT658 NPN [SOT223]; Supplier: LCSC; Supplier Part: C460885; JLCPCB Part Class: Extended Part; spicePre: Q; spiceSymbolName: DZT658-13; Add into BOM: yes; FootprintName: SOT-223-3_L6.5-W3.4-P2.30-LS7.0-BR
VT502 = Транзистор FZT758 PNP [SOT223]: Manufacturer: DIODES(美台); Manufacturer Part: FZT758TA; Contributor: LCSC; Convert to PCB: yes; UniqueId: gge394469088ff2b71d; Origin Footprint: SOT-223_L6.5-W3.5-P2.30-LS7.0-BR; Device: Транзистор FZT758 PNP [SOT223]; Symbol: Транзистор FZT758 PNP [SOT223]; Supplier: LCSC; Supplier Part: C99123; JLCPCB Part Class: Extended Part; spicePre: Q; spiceSymbolName: FZT758TA; Add into BOM: yes; FootprintName: SOT-223_L6.5-W3.5-P2.30-LS7.0-BR
VT503 = Транзистор DZTA42 NPN [SOT223]: Manufacturer: DIODES(美台); Manufacturer Part: DZTA42-13; Contributor: LCSC; Convert to PCB: yes; UniqueId: gge4fac4fba55ed456b; Origin Footprint: SOT-223-4_L6.5-W3.5-P2.30-LS7.0-BR; Device: Транзистор DZTA42 NPN [SOT223]; Symbol: Транзистор DZTA42 NPN [SOT223]; Supplier: LCSC; Supplier Part: C531150; JLCPCB Part Class: Extended Part; spicePre: Q; spiceSymbolName: DZTA42-13; Add into BOM: yes; FootprintName: SOT-223-4_L6.5-W3.5-P2.30-LS7.0-BR
VT504 = Транзистор DZTA92 PNP [SOT223]: Manufacturer: DIODES(美台); Manufacturer Part: DZTA92-13; Contributor: lcsc; Convert to PCB: yes; UniqueId: ggefc5ea93605b3e5c5; Origin Footprint: SOT-223-3_L6.5-W3.4-P2.30-LS7.0-BR; Device: Транзистор DZTA92 PNP [SOT223]; Symbol: Транзистор DZTA92 PNP [SOT223]; Supplier: LCSC; Supplier Part: C5205190; JLCPCB Part Class: Extended Part; spicePre: Q; spiceSymbolName: DZTA92-13; Add into BOM: yes; FootprintName: SOT-223-3_L6.5-W3.4-P2.30-LS7.0-BR
VT505 = Транзистор DZTA92 PNP [SOT223]: Manufacturer: DIODES(美台); Manufacturer Part: DZTA92-13; Contributor: lcsc; Convert to PCB: yes; UniqueId: gge7624d27ec86c8a4b; Origin Footprint: SOT-223-3_L6.5-W3.4-P2.30-LS7.0-BR; Device: Транзистор DZTA92 PNP [SOT223]; Symbol: Транзистор DZTA92 PNP [SOT223]; Supplier: LCSC; Supplier Part: C5205190; JLCPCB Part Class: Extended Part; spicePre: Q; spiceSymbolName: DZTA92-13; Add into BOM: yes; FootprintName: SOT-223-3_L6.5-W3.4-P2.30-LS7.0-BR
VT506 = Транзистор DZTA92 PNP [SOT223]: Manufacturer: DIODES(美台); Manufacturer Part: DZTA92-13; Contributor: lcsc; Convert to PCB: yes; UniqueId: gge28739477f7969935; Origin Footprint: SOT-223-3_L6.5-W3.4-P2.30-LS7.0-BR; Device: Транзистор DZTA92 PNP [SOT223]; Symbol: Транзистор DZTA92 PNP [SOT223]; Supplier: LCSC; Supplier Part: C5205190; JLCPCB Part Class: Extended Part; spicePre: Q; spiceSymbolName: DZTA92-13; Add into BOM: yes; FootprintName: SOT-223-3_L6.5-W3.4-P2.30-LS7.0-BR
VT507 = Транзистор DZTA42 NPN [SOT223]: Manufacturer: DIODES(美台); Manufacturer Part: DZTA42-13; Contributor: LCSC; Convert to PCB: yes; UniqueId: ggefd0584d9838ddb6a; Origin Footprint: SOT-223-4_L6.5-W3.5-P2.30-LS7.0-BR; Device: Транзистор DZTA42 NPN [SOT223]; Symbol: Транзистор DZTA42 NPN [SOT223]; Supplier: LCSC; Supplier Part: C531150; JLCPCB Part Class: Extended Part; spicePre: Q; spiceSymbolName: DZTA42-13; Add into BOM: yes; FootprintName: SOT-223-4_L6.5-W3.5-P2.30-LS7.0-BR
VT508 = Транзистор DZTA42 NPN [SOT223]: Manufacturer: DIODES(美台); Manufacturer Part: DZTA42-13; Contributor: LCSC; Convert to PCB: yes; UniqueId: ggee28c53d24fe70afc; Origin Footprint: SOT-223-4_L6.5-W3.5-P2.30-LS7.0-BR; Device: Транзистор DZTA42 NPN [SOT223]; Symbol: Транзистор DZTA42 NPN [SOT223]; Supplier: LCSC; Supplier Part: C531150; JLCPCB Part Class: Extended Part; spicePre: Q; spiceSymbolName: DZTA42-13; Add into BOM: yes; FootprintName: SOT-223-4_L6.5-W3.5-P2.30-LS7.0-BR
VT509 = Транзистор полевой MOSFET N-канальный BSS138BK [SOT-23-3]: Manufacturer: ElecSuper(静芯); Contributor: lcsc; Convert to PCB: yes; UniqueId: ggef226161c5922261b; Origin Footprint: SOT-23-3_L2.9-W1.3-P1.90-LS2.4-BR; Device: Транзистор полевой MOSFET N-канальный BSS138BK [SOT-23-3]; Symbol: Транзистор полевой MOSFET N-канальный BSS138BK [SOT-23-3]; Supplier: LCSC; Supplier Part: C5224267; Manufacturer Part: BSS138BK; JLCPCB Part Class: Extended Part; spicePre: Q; spiceSymbolName: BSS138BK; Add into BOM: yes; FootprintName: SOT-23-3_L2.9-W1.3-P1.90-LS2.4-BR
XP501 = Вилка на плату 280370-2 шаг 2.54мм: Manufacturer: TE Connectivity; Contributor: jordanjin; Convert to PCB: yes; UniqueId: ggeb59dbef3022bc048; ModelId: 52348b5124d84a51b365c609ac2689aa; Origin Footprint: CONN-TH_280370-2; Device: Вилка на плату 280370-2 шаг 2.54мм; Symbol: Вилка на плату 280370-2 шаг 2.54мм; Supplier: LCSC; Manufacturer Part: 280370-2; JLCPCB Part Class: Extended Part; spicePre: X; spiceSymbolName: Вилка на плату 280370-2 шаг 2.54мм; Add into BOM: yes; FootprintName: CONN-TH_280370-2; ModelName: CONN-TH_280370-2
XP502 = Вилка на плату 280372-1 шаг 2.54мм: Manufacturer: TE Connectivity; Contributor: jordanjin; Convert to PCB: yes; UniqueId: gge7ae518aaf1173b8f; ModelId: 49da86841be14b909aa4008686c699c8; Origin Footprint: CONN-TH_280372-1; Device: Вилка на плату 280372-1 шаг 2.54мм; Symbol: Вилка на плату 280372-1 шаг 2.54мм; Supplier: LCSC; Manufacturer Part: 280372-1; JLCPCB Part Class: Extended Part; spicePre: X; spiceSymbolName: Вилка на плату 280372-1 шаг 2.54мм; Add into BOM: yes; FootprintName: CONN-TH_280372-1; ModelName: CONN-TH_280372-1
XP503 = Вилка на плату 280370-2 шаг 2.54мм: Manufacturer: TE Connectivity; Contributor: jordanjin; Convert to PCB: yes; UniqueId: ggee357d5eeee952ca0; ModelId: 52348b5124d84a51b365c609ac2689aa; Origin Footprint: CONN-TH_280370-2; Device: Вилка на плату 280370-2 шаг 2.54мм; Symbol: Вилка на плату 280370-2 шаг 2.54мм; Supplier: LCSC; Manufacturer Part: 280370-2; JLCPCB Part Class: Extended Part; spicePre: X; spiceSymbolName: Вилка на плату 280370-2 шаг 2.54мм; Add into BOM: yes; FootprintName: CONN-TH_280370-2; ModelName: CONN-TH_280370-2